# EAGLE design display_board (EAGLE 5.11)
DRAWING_NAME: ARVP Display Board; DRAWING_REV: 1.0; DRAWING_TITLE: Displ
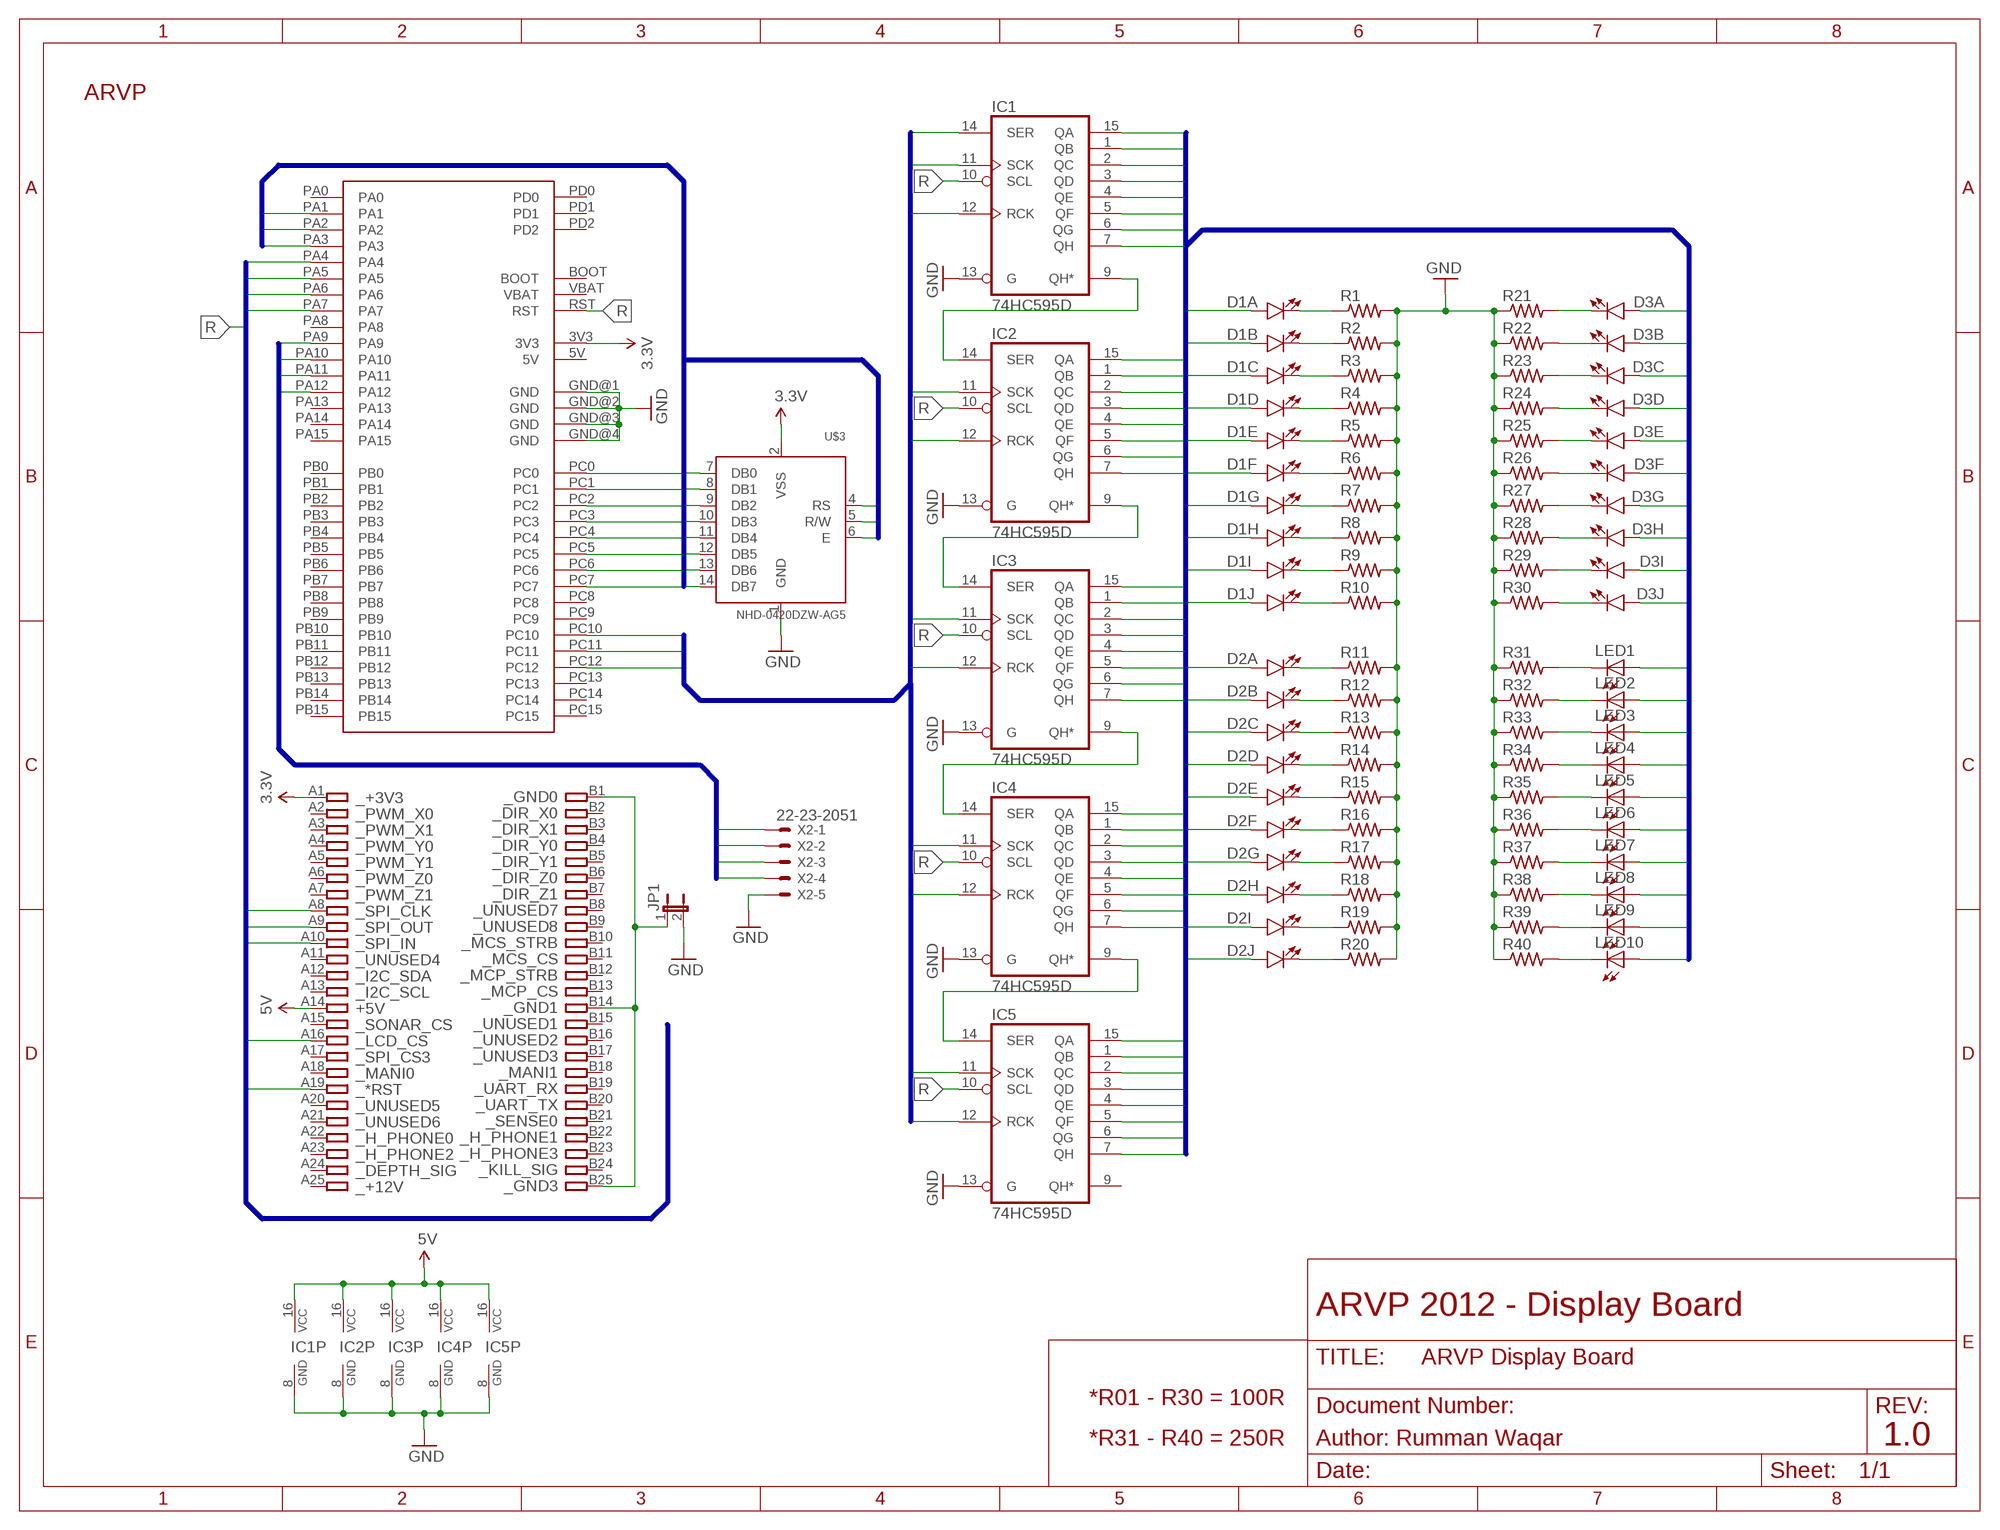
[diagram p0: schematic, sheet 1]

## Parts
D1  LED_BARGRAPH_10  [LED_BARGAPH_10]
D2  LED_BARGRAPH_10  [LED_BARGAPH_10]
D3  LED_BARGRAPH_10  [LED_BARGAPH_10]
IC1  74HC595D  [SO16]
IC2  74HC595D  [SO16]
IC3  74HC595D  [SO16]
IC4  74HC595D  [SO16]
IC5  74HC595D  [SO16]
JP1  JUMPER-2PTH  [1X02]
LED1  LED1206  [LED-1206]
LED2  LED1206  [LED-1206]
LED3  LED1206  [LED-1206]
LED4  LED1206  [LED-1206]
LED5  LED1206  [LED-1206]
LED6  LED1206  [LED-1206]
LED7  LED1206  [LED-1206]
LED8  LED1206  [LED-1206]
LED9  LED1206  [LED-1206]
LED10  LED1206  [LED-1206]
R1  R-US_R0805  [R0805]
R2  R-US_R0805  [R0805]
R3  R-US_R0805  [R0805]
R4  R-US_R0805  [R0805]
R5  R-US_R0805  [R0805]
R6  R-US_R0805  [R0805]
R7  R-US_R0805  [R0805]
R8  R-US_R0805  [R0805]
R9  R-US_R0805  [R0805]
R10  R-US_R0805  [R0805]
R11  R-US_R0805  [R0805]
R12  R-US_R0805  [R0805]
R13  R-US_R0805  [R0805]
R14  R-US_R0805  [R0805]
R15  R-US_R0805  [R0805]
R16  R-US_R0805  [R0805]
R17  R-US_R0805  [R0805]
R18  R-US_R0805  [R0805]
R19  R-US_R0805  [R0805]
R20  R-US_R0805  [R0805]
R21  R-US_R0805  [R0805]
R22  R-US_R0805  [R0805]
R23  R-US_R0805  [R0805]
R24  R-US_R0805  [R0805]
R25  R-US_R0805  [R0805]
R26  R-US_R0805  [R0805]
R27  R-US_R0805  [R0805]
R28  R-US_R0805  [R0805]
R29  R-US_R0805  [R0805]
R30  R-US_R0805  [R0805]
R31  R-US_R0805  [R0805]
R32  R-US_R0805  [R0805]
R33  R-US_R0805  [R0805]
R34  R-US_R0805  [R0805]
R35  R-US_R0805  [R0805]
R36  R-US_R0805  [R0805]
R37  R-US_R0805  [R0805]
R38  R-US_R0805  [R0805]
R39  R-US_R0805  [R0805]
R40  R-US_R0805  [R0805]
U$1  STM32_DISCOVERY  [STM32_DISCOVERY]
U$2  CARD_50PIN  [CARD_50PIN]
U$3  NHD-0420DZW-AG5  [CHARLCD_16PIN]
U$6  ARVP_LOGO  [ARVP]
X2  22-23-2051  [22-23-2051]

## Nets
3.3V: U$1.3V3 U$2.A1 U$3.2(VSS)
5V: IC1.16(VCC) IC2.16(VCC) IC3.16(VCC) IC4.16(VCC) IC5.16(VCC) U$2.A14
_SPI_CLK: U$1.PA5 U$2.A8
_SPI_IN: U$1.PA6 U$2.A10
_SPI_OUT: U$1.PA7 U$2.A9
_SPI_SS: U$1.PA4 U$2.A16
_UART_CTS: U$1.PA11 X2.3
_UART_RTS: U$1.PA12 X2.4
_UART_RX: U$1.PA10 X2.2
_UART_TX: U$1.PA9 X2.1
BAR_A1: D1.1(A:A) IC1.15(QA)
BAR_A2: D1.2(B:A) IC1.1(QB)
BAR_A3: D1.3(C:A) IC1.2(QC)
BAR_A4: D1.4(D:A) IC1.3(QD)
BAR_A5: D1.5(E:A) IC1.4(QE)
BAR_A6: D1.6(F:A) IC1.5(QF)
BAR_A7: D1.7(G:A) IC1.6(QG)
BAR_A8: D1.8(H:A) IC1.7(QH)
BAR_A9: D1.9(I:A) IC2.15(QA)
BAR_A10: D1.10(J:A) IC2.1(QB)
BAR_B1: D2.1(A:A) IC2.2(QC)
BAR_B2: D2.2(B:A) IC2.3(QD)
BAR_B3: D2.3(C:A) IC2.4(QE)
BAR_B4: D2.4(D:A) IC2.5(QF)
BAR_B5: D2.5(E:A) IC2.6(QG)
BAR_B6: D2.6(F:A) IC2.7(QH)
BAR_B7: D2.7(G:A) IC3.15(QA)
BAR_B8: D2.8(H:A) IC3.1(QB)
BAR_B9: D2.9(I:A) IC3.2(QC)
BAR_B10: D2.10(J:A) IC3.3(QD)
BAR_C1: D3.1(A:A) IC3.4(QE)
BAR_C2: D3.2(B:A) IC3.5(QF)
BAR_C3: D3.3(C:A) IC3.6(QG)
BAR_C4: D3.4(D:A) IC3.7(QH)
BAR_C5: D3.5(E:A) IC4.15(QA)
BAR_C6: D3.6(F:A) IC4.1(QB)
BAR_C7: D3.7(G:A) IC4.2(QC)
BAR_C8: D3.8(H:A) IC4.3(QD)
BAR_C9: D3.9(I:A) IC4.4(QE)
BAR_C10: D3.10(J:A) IC4.5(QF)
DB0: U$1.PC0 U$3.7(DB0)
DB1: U$1.PC1 U$3.8(DB1)
DB2: U$1.PC2 U$3.9(DB2)
DB3: U$1.PC3 U$3.10(DB3)
DB4: U$1.PC4 U$3.11(DB4)
DB5: U$1.PC5 U$3.12(DB5)
DB6: U$1.PC6 U$3.13(DB6)
DB7: U$1.PC7 U$3.14(DB7)
DS: IC1.14(SER) U$1.PC12
E: U$1.PA3 U$3.6(E)
GND: IC1.8(GND) IC1.13(G) IC2.8(GND) IC2.13(G) IC3.8(GND) IC3.13(G) IC4.8(GND) IC4.13(G) IC5.8(GND) IC5.13(G) JP1.2 R1.2 R2.2 R3.2 R4.2 R5.2 R6.2 R7.2 R8.2 R9.2 R10.2 R11.2 R12.2 R13.2 R14.2 R15.2 R16.2 R17.2 R18.2 R19.2 R20.2 R21.1 R22.1 R23.1 R24.1 R25.1 R26.1 R27.1 R28.1 R29.1 R30.1 R31.1 R32.1 R33.1 R34.1 R35.1 R36.1 R37.1 R38.1 R39.1 R40.1 U$1.GND@1(GND) U$1.GND@2(GND) U$1.GND@3(GND) U$1.GND@4(GND) U$3.1(GND) X2.5
LED1: IC4.6(QG) LED1.A
LED2: IC4.7(QH) LED2.A
LED3: IC5.15(QA) LED3.A
LED4: IC5.1(QB) LED4.A
LED5: IC5.2(QC) LED5.A
LED6: IC5.3(QD) LED6.A
LED7: IC5.4(QE) LED7.A
LED8: IC5.5(QF) LED8.A
LED9: IC5.6(QG) LED9.A
LED10: IC5.7(QH) LED10.A
N$1: D1.20(A:C) R1.1
N$2: D1.19(B:C) R2.1
N$3: D1.18(C:C) R3.1
N$4: D1.17(D:C) R4.1
N$5: D1.16(E:C) R5.1
N$6: D1.15(F:C) R6.1
N$7: D1.14(G:C) R7.1
N$8: D1.13(H:C) R8.1
N$9: D1.12(I:C) R9.1
N$10: D1.11(J:C) R10.1
N$11: D2.20(A:C) R11.1
N$12: D2.19(B:C) R12.1
N$13: D2.18(C:C) R13.1
N$14: D2.17(D:C) R14.1
N$15: D2.16(E:C) R15.1
N$16: D2.15(F:C) R16.1
N$17: D2.14(G:C) R17.1
N$18: D2.13(H:C) R18.1
N$19: D2.12(I:C) R19.1
N$20: D2.11(J:C) R20.1
N$21: LED10.C R40.2
N$22: LED9.C R39.2
N$23: LED8.C R38.2
N$24: LED7.C R37.2
N$25: LED6.C R36.2
N$26: LED5.C R35.2
N$27: LED4.C R34.2
N$28: LED3.C R33.2
N$29: LED2.C R32.2
N$30: LED1.C R31.2
N$31: D3.11(J:C) R30.2
N$32: D3.12(I:C) R29.2
N$33: D3.13(H:C) R28.2
N$34: D3.14(G:C) R27.2
N$35: D3.15(F:C) R26.2
N$36: D3.16(E:C) R25.2
N$37: D3.17(D:C) R24.2
N$38: D3.18(C:C) R23.2
N$39: D3.19(B:C) R22.2
N$40: D3.20(A:C) R21.2
N$41: IC3.9(QH*) IC4.14(SER)
N$42: IC4.9(QH*) IC5.14(SER)
N$46: JP1.1 U$2.B1 U$2.B14 U$2.B25
N$49: IC1.9(QH*) IC2.14(SER)
N$50: IC2.9(QH*) IC3.14(SER)
R: IC1.10(SCL) IC2.10(SCL) IC3.10(SCL) IC4.10(SCL) IC5.10(SCL) U$1.RST U$2.A19
RS: U$1.PA1 U$3.4(RS)
RW: U$1.PA2 U$3.5(R/W)
SH_CP: IC1.11(SCK) IC2.11(SCK) IC3.11(SCK) IC4.11(SCK) IC5.11(SCK) U$1.PC10
ST_CP: IC1.12(RCK) IC2.12(RCK) IC3.12(RCK) IC4.12(RCK) IC5.12(RCK) U$1.PC11
Unconnected: IC5.9(QH*) U$1.5V U$1.BOOT U$1.NC@1(NC) U$1.NC@2(NC) U$1.PA0 U$1.PA8 U$1.PA13 U$1.PA14 U$1.PA15 U$1.PB0 U$1.PB1 U$1.PB2 U$1.PB3 U$1.PB4 U$1.PB5 U$1.PB6 U$1.PB7 U$1.PB8 U$1.PB9 U$1.PB10 U$1.PB11 U$1.PB12 U$1.PB13 U$1.PB14 U$1.PB15 U$1.PC8 U$1.PC9 U$1.PC13 U$1.PC14 U$1.PC15 U$1.PD0 U$1.PD1 U$1.PD2 U$1.VBAT U$2.A2 U$2.A3 U$2.A4 U$2.A5 U$2.A6 U$2.A7 U$2.A11 U$2.A12 U$2.A13 U$2.A15 U$2.A17 U$2.A18 U$2.A20 U$2.A21 U$2.A22 U$2.A23 U$2.A24 U$2.A25 U$2.B2 U$2.B3 U$2.B4 U$2.B5 U$2.B6 U$2.B7 U$2.B8 U$2.B9 U$2.B10 U$2.B11 U$2.B12 U$2.B13 U$2.B15 U$2.B16 U$2.B17 U$2.B18 U$2.B19 U$2.B20 U$2.B21 U$2.B22 U$2.B23 U$2.B24

## Buses
RS,RW,E,DB[0..7]
BAR_A[1..10],BAR_B[1..10],BAR_C[1..10],LED[1..10]
DS,SH_CP,ST_CP
_SPI_IN,_SPI_OUT,_SPI_CLK,_SPI_SS,R
_UART_RX,_UART_TX,_UART_RTS,_UART_CTS

## Notes on the sheet
- ARVP 2012 - Display Board
- *R01 - R30 = 100R
- *R31 - R40 = 250R | Author: Rumman Waqar | 1.0

## Library data of the parts
D1-D3 = SparkFun:LED_BARGRAPH_10: 10-Segment LED Bar Graph SFE part numbers: COM-09935 (red, Vf = 2.1V, Ifmax = 20mA) COM-09936 (yellow, Vf = 2.1V, Ifmax = 20mA) COM-09937 (blue, Vf = 3.4V, Ifmax = 20mA) COM-09938 (green, Vf = 3.4V, Ifmax = 20mA)
IC1-IC5 = 74xx-eu:74*595: 8-bit SHIFT REGISTER, output latch
JP1 = SparkFun:JUMPER-2: Jumper Basic 0.1" spaced jumper. Use with breakaway headers.
LED1-LED10 = SparkFun:LED: LEDs Standard schematic elements and footprints for 5mm, 3mm, 1206, and 0603 sized LEDs. 5mm - Spark Fun Electronics SKU : COM-00529 (and others)
R1-R40 = rcl:R-US_: RESISTOR, American symbol
U$1 = stm32_discovery:STM32_DISCOVERY: STM32 Value line discovery
U$2 = ARVP:CARD_50PIN
U$3 = Display:NHD-0420DZW-AG5: 20 x 4 Character OLED DIsplay Module
U$6 = ARVP:ARVP_LOGO
X2 = con-molex:22-23-2051: .100" (2.54mm) Center Header - 5 Pin; MF: MOLEX; MPN: 22-23-2051; OC_FARNELL: 1462952; OC_NEWARK: 38C9178

## Board
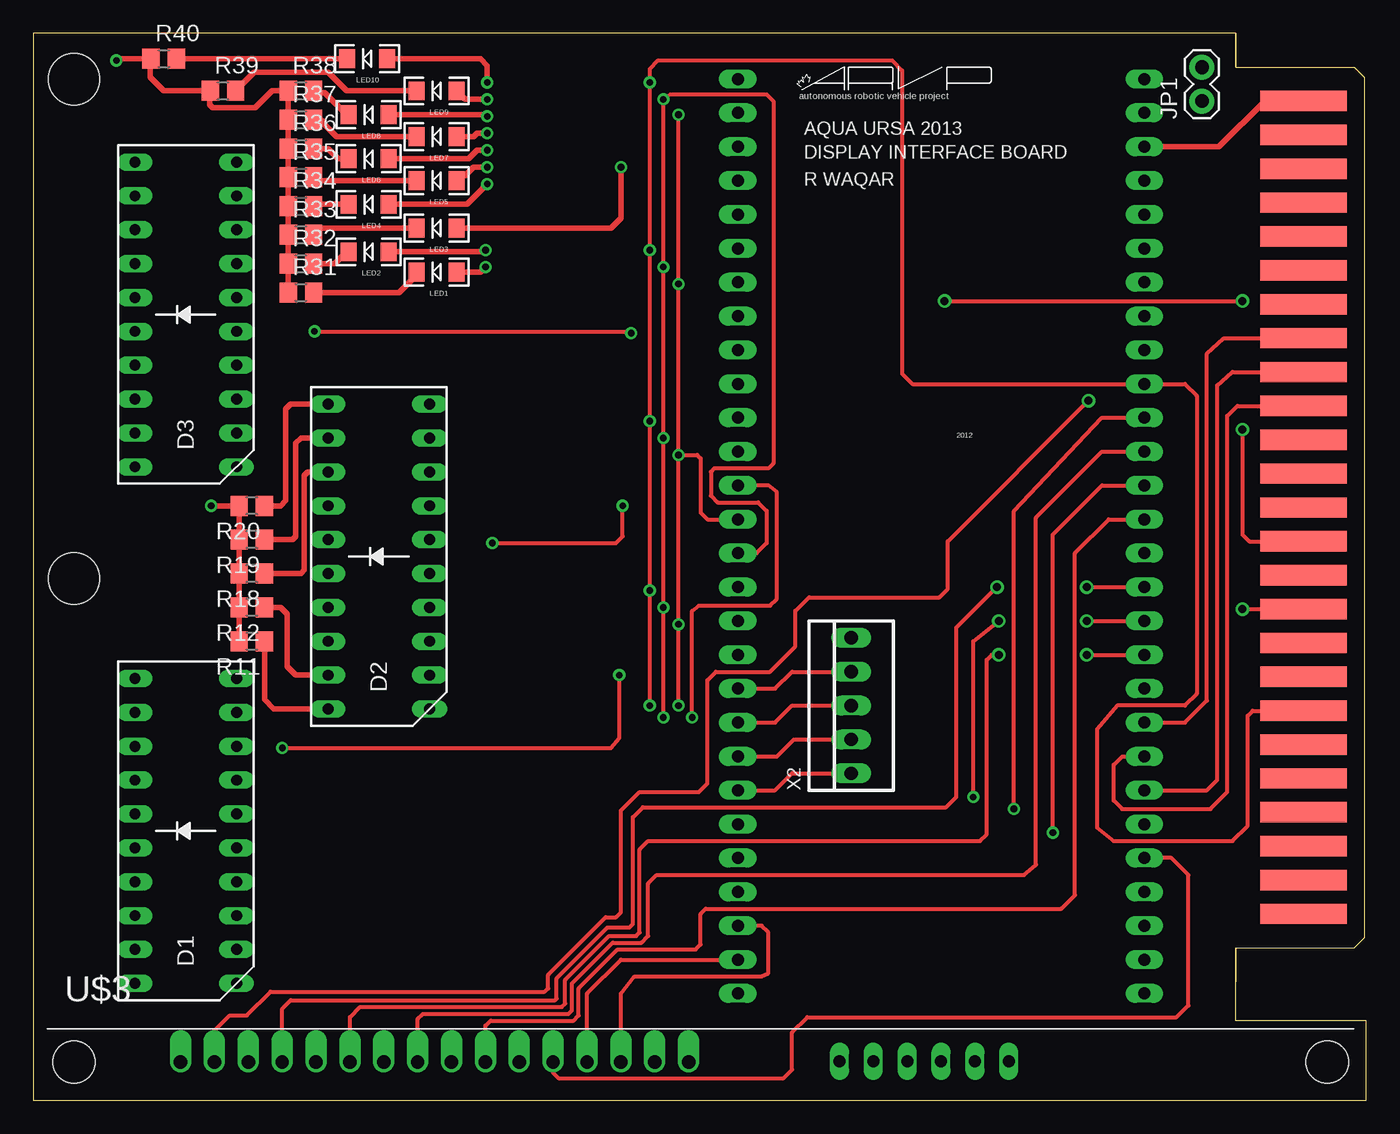
[diagram p1: board, top side]
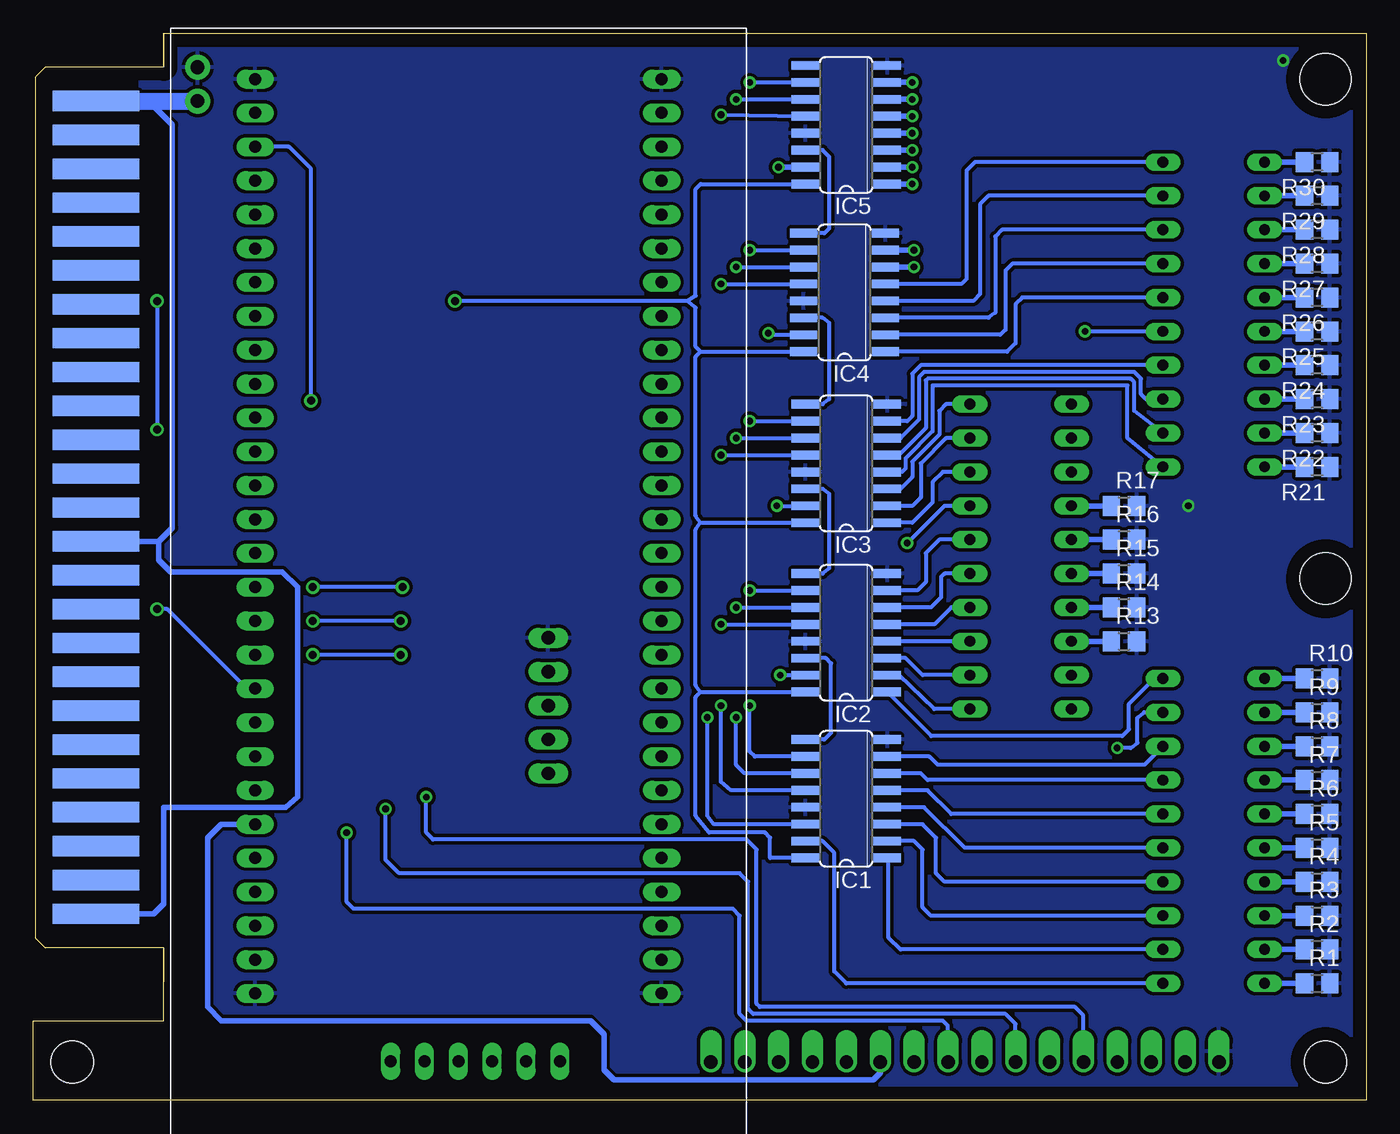
[diagram p2: board, bottom side, seen from below]

Size 99.95 x 80.01 mm. Coordinates in mm from the lower left corner, seen from the top.
Outline: 90.17,11.43 90.17,5.97 99.95,5.97 99.95,0 0,0 0,80 90.17,80.01 90.17,77.46
Copper layers (1*16): Top 0.035mm / dielectric 1.5mm / Bottom 0.035mm
Design rules "default *": minimum track width 10mil, minimum drill 19mil, track to track 7mil, track to pad 7mil, pad to pad 7mil, via to via 7mil, smd to smd 7mil, copper to edge 40mil, drill to drill 8mil, minimum pad ring 10mil, minimum via ring 8mil, stop-mask expansion 4mil, vias tented up to drill 0mil, thermal gap 10mil
Holes 3.86 mm at 3.05,39.12 3.05,76.58

### Footprints (pad centres in the part's own frame; a part is rotated, then mirrored left to right if it is on the bottom)
LED_BARGAPH_10 = drill 0.813 long: 1 -11.43,-3.81; 2 -8.89,-3.81; 3 -6.35,-3.81; 4 -3.81,-3.81; 5 -1.27,-3.81; 6 1.27,-3.81; 7 3.81,-3.81; 8 6.35,-3.81; 9 8.89,-3.81; 10 11.43,-3.81; 11 11.43,3.81; 12 8.89,3.81; 13 6.35,3.81; 14 3.81,3.81; 15 1.27,3.81; 16 -1.27,3.81; 17 -3.81,3.81; 18 -6.35,3.81; 19 -8.89,3.81; 20 -11.43,3.81
SO16 = smd 0.66 x 2.032: 1 -4.445,-3.073; 2 -3.175,-3.073; 3 -1.905,-3.073; 4 -0.635,-3.073; 5 0.635,-3.073; 6 1.905,-3.073; 7 3.175,-3.073; 8 4.445,-3.073; 9 4.445,3.073; 10 3.175,3.073; 11 1.905,3.073; 12 0.635,3.073; 13 -0.635,3.073; 14 -1.905,3.073; 15 -3.175,3.073; 16 -4.445,3.073
1X02 = drill 1.016 pad 1.88 round: 1 0,0; 2 2.54,0
LED-1206 = smd 1.2 x 1.4: A -1.5,0; C 1.5,0
R0805 = smd 1.3 x 1.5: 1 -0.95,0; 2 0.95,0
STM32_DISCOVERY = drill 0.9 long: 3V3 -15.24,29.21; 5V 15.24,29.21; BOOT 15.24,21.59; GND@1 -15.24,34.29; GND@2 15.24,34.29; GND@3 -15.24,-34.29; GND@4 15.24,-34.29; NC@1 -15.24,31.75; NC@2 15.24,31.75; PA0 -15.24,-1.27; PA1 -15.24,-3.81; PA2 -15.24,-6.35; PA3 -15.24,-8.89; PA4 -15.24,-11.43; PA5 -15.24,-13.97; PA6 -15.24,-16.51; PA7 -15.24,-19.05; PA8 15.24,-21.59; PA9 15.24,-19.05; PA10 15.24,-16.51; PA11 15.24,-13.97; PA12 15.24,-11.43; PA13 15.24,-8.89; PA14 15.24,-6.35; PA15 15.24,-3.81; PB0 -15.24,-26.67; PB1 -15.24,-29.21; PB2 -15.24,-31.75; PB3 15.24,8.89; PB4 15.24,11.43; PB5 15.24,13.97; PB6 15.24,16.51; PB7 15.24,19.05; PB8 15.24,24.13; PB9 15.24,26.67; PB10 -5.08,-39.37; PB11 -2.54,-39.37; PB12 0,-39.37; PB13 2.54,-39.37; PB14 5.08,-39.37; PB15 7.62,-39.37; PC0 -15.24,8.89; PC1 -15.24,6.35; PC2 -15.24,3.81; PC3 -15.24,1.27; PC4 -15.24,-21.59; PC5 -15.24,-24.13; PC6 15.24,-31.75; PC7 15.24,-29.21; PC8 15.24,-26.67; PC9 15.24,-24.13; PC10 15.24,-1.27; PC11 15.24,1.27; PC12 15.24,3.81; PC13 -15.24,24.13; PC14 -15.24,21.59; PC15 -15.24,19.05; PD0 -15.24,16.51; PD1 -15.24,13.97; PD2 15.24,6.35; RST -15.24,11.43; VBAT -15.24,26.67
CARD_50PIN = smd 1.524 x 6.477: A1 63.5,3.81; A2 60.96,3.81; A3 58.42,3.81; A4 55.88,3.81; A5 53.34,3.81; A6 50.8,3.81; A7 48.26,3.81; A8 45.72,3.81; A9 43.18,3.81; A10 40.64,3.81; A11 38.1,3.81; A12 35.56,3.81; A13 33.02,3.81; A14 30.48,3.81; A15 27.94,3.81; A16 25.4,3.81; A17 22.86,3.81; A18 20.32,3.81; A19 17.78,3.81; A20 15.24,3.81; A21 12.7,3.81; A22 10.16,3.81; A23 7.62,3.81; A24 5.08,3.81; A25 2.54,3.81 | smd 1.524 x 6.477 bottom: B1 63.5,3.81; B2 60.96,3.81; B3 58.42,3.81; B4 55.88,3.81; B5 53.34,3.81; B6 50.8,3.81; B7 48.26,3.81; B8 45.72,3.81; B9 43.18,3.81; B10 40.64,3.81; B11 38.1,3.81; B12 35.56,3.81; B13 33.02,3.81; B14 30.48,3.81; B15 27.94,3.81; B16 25.4,3.81; B17 22.86,3.81; B18 20.32,3.81; B19 17.78,3.81; B20 15.24,3.81; B21 12.7,3.81; B22 10.16,3.81; B23 7.62,3.81; B24 5.08,3.81; B25 2.54,3.81
CHARLCD_16PIN = drill 1 pad 1.6 offset: 1 -39,27.5; 2 -36.46,27.5; 3 -33.92,27.5; 4 -31.38,27.5; 5 -28.84,27.5; 6 -26.3,27.5; 7 -23.76,27.5; 8 -21.22,27.5; 9 -18.68,27.5; 10 -16.14,27.5; 11 -13.6,27.5; 12 -11.06,27.5; 13 -8.52,27.5; 14 -5.98,27.5; 15 -3.44,27.5; 16 -0.9,27.5 | hole 3.175: -47,27.5; 47,27.5
22-23-2051 = drill 1 long: 1 -5.08,0; 2 -2.54,0; 3 0,0; 4 2.54,0; 5 5.08,0

### Placement (x,y rotation side)
D1  11.43,20.19 90 top
D2  25.91,40.77 90 top
D3  11.43,58.93 90 top
IC1  38.99,22.61 90 bottom
IC2  38.99,35.05 90 bottom
IC3  38.99,47.75 90 bottom
IC4  39.12,60.58 90 bottom
IC5  38.99,73.15 90 bottom
JP1  87.63,74.93 90 top
LED1  30.23,62.1 180 top
LED2  25.15,63.63 180 top
LED3  30.23,65.41 180 top
LED4  25.15,67.18 180 top
LED5  30.23,68.96 180 top
LED6  25.15,70.61 180 top
LED7  30.23,72.26 180 top
LED8  25.15,73.91 180 top
LED9  30.23,75.69 180 top
LED10  25.02,78.11 180 top
R1  3.68,8.76 0 bottom
R2  3.68,11.3 0 bottom
R3  3.68,13.84 0 bottom
R4  3.68,16.38 0 bottom
R5  3.68,18.92 0 bottom
R6  3.68,21.46 0 bottom
R7  3.68,24 0 bottom
R8  3.68,26.54 0 bottom
R9  3.68,29.08 0 bottom
R10  3.68,31.62 0 bottom
R11  16.38,34.42 180 top
R12  16.38,36.96 180 top
R13  18.16,34.42 0 bottom
R14  18.16,36.96 0 bottom
R15  18.16,39.5 0 bottom
R16  18.16,42.04 0 bottom
R17  18.16,44.58 0 bottom
R18  16.38,39.5 180 top
R19  16.38,42.04 180 top
R20  16.38,44.58 180 top
R21  3.68,47.5 180 bottom
R22  3.68,50.04 180 bottom
R23  3.68,52.58 180 bottom
R24  3.68,55.12 180 bottom
R25  3.68,57.66 180 bottom
R26  3.68,60.2 180 bottom
R27  3.68,62.74 180 bottom
R28  3.68,65.28 180 bottom
R29  3.68,67.82 180 bottom
R30  3.68,70.36 180 bottom
R31  20.07,60.58 0 top
R32  20.07,62.74 0 top
R33  20.07,64.9 0 top
R34  20.07,67.06 0 top
R35  20.07,69.22 0 top
R36  20.07,71.37 0 top
R37  20.07,73.53 0 top
R38  20.07,75.69 0 top
R39  14.22,75.69 0 top
R40  9.78,78.11 0 top
U$1  68.07,42.29 0 bottom
U$2  99.06,11.43 90 top
U$3  50.04,-24.64 0 top
U$6  57.4,75.06 0 top
X2  61.34,29.59 90 top

### Tracks (layer width: path | path; a pad name or v marks a point on that pad's centre or on a via)
3.3V  (via drill 0.6)
  Top 0.305: v79.12,52.45 68.58,41.91 68.58,38.35 67.94,37.72 58.17,37.72 57.15,36.7 57.15,34.04 55.24,32.13 51.18,32.13 50.55,31.5 50.55,23.75 49.91,23.11 45.47,23.11 44.07,21.72 44.07,14.1 43.69,13.72 42.93,13.72 38.61,9.4 38.61,8.38 38.35,8.13 17.78,8.13 16,6.35 14.73,6.35 13.58,5.2 U$3.2
  Top 0.406: U$2.A1 92.33,74.93 88.9,71.5 U$1.3V3
  Bottom 0.305: v79.12,52.45 79.12,69.85 80.77,71.5 U$1.3V3
5V  (via drill 0.6)
  Top 0.305: U$2.A14 91.19,41.91 90.68,42.42 v90.68,50.29 | v68.33,59.94 v90.68,59.94
  Bottom 0.305: IC1.16 44.7,18.16 44.7,19.68 45.09,20.07 49.28,20.07 50.29,21.34 50.29,30.23 49.91,30.61 | 49.91,30.61 IC2.16 | 49.91,43.31 IC3.16 | 49.91,43.31 50.29,42.8 50.29,31.11 49.91,30.61 | 49.91,56.13 IC4.16 | 49.91,56.13 50.29,55.75 50.29,43.81 49.91,43.31 | IC5.16 49.91,68.71 50.29,68.33 50.29,60.33 50.93,59.94 | 49.91,56.13 50.29,56.52 50.29,59.44 50.93,59.94 | 50.93,59.94 v68.33,59.94 | v90.68,59.94 v90.68,50.29
_SPI_CLK
  Top 0.305: U$1.PA5 86.36,28.32 88.01,29.97 88.01,56.01 89.28,57.15 U$2.A8
_SPI_IN
  Top 0.305: U$1.PA6 81.66,25.78 81.03,25.15 81.03,22.48 81.66,21.84 88.27,21.84 89.53,23.11 89.53,51.31 90.3,52.07 U$2.A10
_SPI_OUT
  Top 0.305: U$2.A9 89.92,54.61 88.77,53.59 88.77,24 88.01,23.24 U$1.PA7
_SPI_SS  (via drill 0.6)
  Top 0.305: v90.68,36.83 U$2.A16
  Bottom 0.305: U$1.PA4 83.95,30.86 89.92,36.83 v90.68,36.83
_UART_CTS
  Top 0.305: U$1.PA11 55.63,28.32 56.9,29.59 X2.3
_UART_RTS
  Top 0.305: U$1.PA12 55.63,30.86 56.9,32.13 X2.4
_UART_RX
  Top 0.305: X2.2 57.02,27.05 55.75,25.78 U$1.PA10
_UART_TX
  Top 0.305: U$1.PA9 55.63,23.24 56.9,24.51 X2.1
BAR_A1
  Bottom 0.305: D1.1 38.99,8.76 39.88,9.65 39.88,18.54 40.77,19.43 IC1.15
BAR_A2
  Bottom 0.305: D1.2 34.92,11.3 35.81,12.19 35.81,18.06 IC1.1
BAR_A3
  Bottom 0.305: D1.3 32.64,13.84 33.27,14.48 33.27,18.8 33.91,19.43 IC1.2
BAR_A4
  Bottom 0.305: D1.4 31.62,16.38 32.26,17.02 32.26,19.68 33.27,20.7 IC1.3
BAR_A5
  Bottom 0.305: D1.5 30.1,18.92 33.15,21.97 IC1.4
BAR_A6
  Bottom 0.305: D1.6 31.11,21.46 32.89,23.24 IC1.5
BAR_A7
  Bottom 0.305: D1.7 32.89,24 33.4,24.51 IC1.6
BAR_A8
  Bottom 0.305: D1.8 16.64,25.15 32.13,25.15 32.77,25.78 IC1.7
BAR_A9  (via drill 0.5 pad 0.3)
  Top 0.305: v18.67,26.42 43.31,26.42 43.94,27.18 v43.94,31.88
  Bottom 0.305: D1.9 16.64,29.08 17.14,28.7 17.14,26.8 17.65,26.42 v18.67,26.42 | v43.94,31.88 IC2.15
BAR_A10
  Bottom 0.305: D1.10 15.88,31.62 17.78,29.72 17.78,27.81 18.29,27.3 32.61,27.3 IC2.1
BAR_B1
  Bottom 0.305: D2.1 32.38,29.34 35.05,31.88 IC2.2
BAR_B2
  Bottom 0.305: D2.2 33.27,31.88 34.54,33.15 IC2.3
BAR_B3
  Bottom 0.305: D2.3 IC2.4
BAR_B4
  Bottom 0.305: D2.4 31.11,36.96 32.38,35.69 IC2.5
BAR_B5
  Bottom 0.305: D2.5 31.62,39.5 31.88,39.24 31.88,37.72 32.64,36.96 IC2.6
BAR_B6
  Bottom 0.305: IC2.7 33.66,38.23 33.02,38.86 33.02,41.02 32,42.04 D2.6
BAR_B7  (via drill 0.5 pad 0.3)
  Top 0.305: v34.42,41.78 43.69,41.78 44.2,42.29 v44.2,44.58
  Bottom 0.305: v44.2,44.58 IC3.15 | D2.7 31.62,44.58 v34.42,41.78
BAR_B8
  Bottom 0.305: IC3.1 34.04,43.31 32.51,44.83 32.51,46.35 31.75,47.12 D2.8
BAR_B9
  Bottom 0.305: IC3.2 34.04,44.58 33.4,45.21 33.4,47.75 31.5,49.66 D2.9
BAR_B10
  Bottom 0.305: IC3.3 34.92,45.85 34.04,46.74 34.04,47.88 32,49.91 32,51.69 31.5,52.2 D2.10
BAR_C1
  Bottom 0.305: D3.1 17.91,49.66 17.91,53.59 32.51,53.59 32.51,50.16 34.54,48.13 34.54,47.37 34.8,47.12 IC3.4
BAR_C2
  Bottom 0.305: IC3.5 35.05,48.39 33.02,50.42 33.02,53.98 32.89,54.1 17.65,54.1 17.4,53.85 17.4,51.69 D3.2
BAR_C3
  Bottom 0.305: IC3.6 34.92,49.66 33.53,51.05 33.53,54.23 33.15,54.61 17.4,54.61 16.89,54.1 16.89,52.96 16.51,52.58 D3.3
BAR_C4
  Bottom 0.305: D3.4 33.4,55.12 34.04,54.48 34.04,51.31 34.42,50.93 IC3.7
BAR_C5  (via drill 0.5 pad 0.3)
  Top 0.305: v21.08,57.66 44.7,57.66 v44.83,57.53
  Bottom 0.305: D3.5 v21.08,57.66 | IC4.15 44.7,57.4 v44.83,57.53
BAR_C6
  Bottom 0.305: D3.6 25.78,60.2 26.29,59.69 26.29,56.77 26.92,56.13 IC4.1
BAR_C7
  Bottom 0.305: D3.7 26.54,62.74 27.05,62.23 27.05,57.78 27.43,57.4 IC4.2
BAR_C8
  Bottom 0.305: IC4.3 28.32,58.67 27.81,59.05 27.81,64.77 27.3,65.28 D3.8
BAR_C9
  Bottom 0.305: D3.9 28.32,67.82 28.96,67.18 28.96,60.45 29.46,59.94 IC4.4
BAR_C10
  Bottom 0.305: IC4.5 30.35,61.21 29.97,61.59 29.97,69.72 29.34,70.36 D3.10
DB0  (via drill 0.5 pad 0.3)
  Top 0.305: U$1.PC0 80.14,51.18 73.53,44.2 v73.53,21.84 | U$3.7 26.29,2.87
  Bottom 0.305: v73.53,21.84 73.53,18.03 72.52,17.02 46.99,17.02 46.35,16.38 46.35,6.86 45.97,6.48 27.05,6.48 26.29,5.71 26.29,2.87 U$3.7
DB1
  Top 0.305: U$1.PC1 80.14,48.64 75.18,43.69 75.18,17.65 74.3,16.89 46.74,16.89 46.1,16.26 46.1,12.32 45.59,11.81 43.43,11.81 40.39,8.76 40.39,6.73 40.13,6.48 29.21,6.48 28.83,6.1 28.83,5.33 28.82,5.32 U$3.8
DB2  (via drill 0.5 pad 0.3)
  Top 0.305: U$1.PC2 80.14,46.1 76.45,42.42 v76.45,20.07
  Bottom 0.305: v76.45,20.07 76.45,14.86 75.95,14.35 47.5,14.35 46.99,13.84 46.99,6.48 46.48,5.97 31.75,5.97 31.37,5.59 31.37,2.87 U$3.9
DB3
  Top 0.305: U$1.PC3 80.64,43.56 78.11,41.02 78.11,15.37 77.09,14.35 50.42,14.35 50.04,13.97 50.04,11.68 49.66,11.3 43.81,11.3 40.89,8.38 40.89,6.35 40.51,5.97 34.29,5.97 33.91,5.59 33.91,2.87 U$3.10
DB4
  Bottom 0.406: U$3.11 36.44,2.04 36.96,1.52 56.39,1.52 57.15,2.29 57.15,4.95 58.17,5.97 85.85,5.97 86.87,6.99 86.87,19.68 85.85,20.7 U$1.PC4
DB5
  Top 0.305: U$3.12 38.98,2.04 39.37,1.65 56.26,1.65 56.9,2.29 56.9,5.08 58.04,6.22 85.72,6.22 86.61,7.11 86.61,16.89 85.34,18.16 U$1.PC5
DB6
  Top 0.305: U$1.PC6 44.07,10.54 41.53,8 41.53,2.87 U$3.13
DB7
  Top 0.305: U$3.14 44.06,7.99 45.09,9.27 54.61,9.27 55.12,9.53 55.12,12.57 54.61,13.08 U$1.PC7
DS  (via drill 0.5 pad 0.3)
  Top 0.305: v49.4,28.7 49.4,36.7 49.91,37.08 55.24,37.08 55.75,37.59 55.75,45.59 55.12,46.1 U$1.PC12
  Bottom 0.305: IC1.14 48.9,20.7 49.4,21.34 v49.4,28.7
E  (via drill 0.6)
  Top 0.305: v78.99,33.4 U$1.PA3 | v72.39,33.4 71.88,33.4 71.5,33.02 71.5,19.94 70.99,19.43 46.1,19.43 45.47,18.8 45.47,12.57 45.21,12.32 43.18,12.32 39.88,9.02 39.88,7.24 39.62,6.99 24.51,6.99 23.75,6.22 23.75,2.87 U$3.6
  Bottom 0.305: v72.39,33.4 v78.99,33.4
GND  (via drill 0.5 pad 0.3)
  Top 0.406: R31.1 R32.1 R33.1 R34.1 R35.1 | R35.1 19.18,69.22 | R35.1 R36.1 R37.1 R38.1 17.91,75.69 16.64,74.42 13.46,74.42 13.21,74.68 13.21,75.63 R39.1 9.78,75.69 8.76,76.71 8.76,78.04 R40.1 6.35,78.11 v6.22,77.98 | R11.2 R12.2 R18.2 R19.2 R20.2 v13.34,44.58
  pour Bottom (isolate 0.254): 0,80.01 91.95,80.01 91.82,0.13 0,0
LED1  (via drill 0.5 pad 0.3)
  Top 0.406: LED1.A 33.53,62.1 v33.91,62.48
  Bottom 0.406: v33.91,62.48 IC4.6
LED2  (via drill 0.5 pad 0.3)
  Top 0.406: LED2.A 33.78,63.63 v33.91,63.75
  Bottom 0.406: v33.91,63.75 IC4.7
LED3  (via drill 0.5 pad 0.3)
  Top 0.406: LED3.A 43.31,65.41 44.07,66.17 v44.07,69.98
  Bottom 0.406: v44.07,69.98 IC5.15
LED4  (via drill 0.5 pad 0.3)
  Top 0.406: LED4.A 32.51,67.18 v34.04,68.71
  Bottom 0.406: v34.04,68.71 IC5.1
LED5  (via drill 0.5 pad 0.3)
  Top 0.406: v34.04,69.98 33.02,69.98 32.38,69.34 32.11,69.34 LED5.A
  Bottom 0.406: v34.04,69.98 IC5.2
LED6  (via drill 0.5 pad 0.3)
  Top 0.406: LED6.A 32.64,70.61 33.27,71.25 v34.04,71.25
  Bottom 0.406: v34.04,71.25 IC5.3
LED7  (via drill 0.5 pad 0.3)
  Top 0.406: LED7.A 33.02,72.26 33.27,72.52 v34.04,72.52
  Bottom 0.406: v34.04,72.52 IC5.4
LED8  (via drill 0.5 pad 0.3)
  Top 0.406: LED8.A 33.91,73.91 v34.04,73.79
  Bottom 0.406: v34.04,73.79 IC5.5
LED9  (via drill 0.5 pad 0.3)
  Top 0.406: v34.04,75.06 32.36,75.06 LED9.A
  Bottom 0.406: v34.04,75.06 IC5.6
LED10  (via drill 0.5 pad 0.3)
  Top 0.406: LED10.A 33.53,78.11 34.04,77.6 v34.04,76.33
  Bottom 0.406: v34.04,76.33 IC5.7
N$1
  Bottom 0.406: R1.1 D1.20
N$2
  Bottom 0.406: R2.1 D1.19
N$3
  Bottom 0.406: R3.1 D1.18
N$4
  Bottom 0.406: R4.1 D1.17
N$5
  Bottom 0.406: R5.1 D1.16
N$6
  Bottom 0.406: R6.1 D1.15
N$7
  Bottom 0.406: R7.1 D1.14
N$8
  Bottom 0.406: R8.1 D1.13
N$9
  Bottom 0.406: R9.1 D1.12
N$10
  Bottom 0.406: R10.1 D1.11
N$11
  Top 0.406: R11.1 17.33,30.04 18.03,29.34 D2.20
N$12
  Top 0.406: D2.19 19.68,31.88 19.05,32.51 19.05,36.45 18.54,36.96 R12.1
N$13
  Bottom 0.406: R13.1 D2.18
N$14
  Bottom 0.406: R14.1 D2.17
N$15
  Bottom 0.406: R15.1 D2.16
N$16
  Bottom 0.406: R16.1 D2.15
N$17
  Bottom 0.406: R17.1 D2.14
N$18
  Top 0.406: R18.1 20.07,39.5 20.32,39.75 20.32,46.86 20.57,47.12 D2.13
N$19
  Top 0.406: R19.1 19.43,42.04 19.68,42.29 19.68,49.28 20.07,49.66 D2.12
N$20
  Top 0.406: D2.11 19.3,52.2 18.92,51.82 18.92,44.96 18.54,44.58 R20.1
N$21
  Top 0.406: R40.2 LED10.C
N$22
  Top 0.406: LED9.C 23.5,75.69 22.1,77.09 16.57,77.09 R39.2
N$23
  Top 0.406: LED8.C 23.5,73.91 21.84,75.56 21.14,75.56 R38.2
N$24
  Top 0.406: LED7.C 22.73,72.26 21.72,73.28 21.72,73.41 21.59,73.53 R37.2
N$25
  Top 0.406: LED6.C 22.86,70.61 22.1,71.37 R36.2
N$26
  Top 0.406: LED5.C 21.27,68.96 R35.2
N$27
  Top 0.406: LED4.C 21.14,67.18 R34.2
N$28
  Top 0.406: LED3.C 21.52,65.41 R33.2
N$29
  Top 0.406: LED2.C 23.5,63.63 22.61,62.74 R32.2
N$30
  Top 0.406: LED1.C 28.73,61.87 27.43,60.58 R31.2
N$31
  Bottom 0.406: R30.2 D3.11
N$32
  Bottom 0.406: R29.2 D3.12
N$33
  Bottom 0.406: R28.2 D3.13
N$34
  Bottom 0.406: R27.2 D3.14
N$35
  Bottom 0.406: R26.2 D3.15
N$36
  Bottom 0.406: R25.2 D3.16
N$37
  Bottom 0.406: R24.2 D3.17
N$38
  Bottom 0.406: R23.2 D3.18
N$39
  Bottom 0.406: R22.2 D3.19
N$40
  Bottom 0.406: R21.2 D3.20
N$41
  Bottom 0.305: IC3.9 40.77,52.2 40.26,52.58 40.26,58.29 40.77,58.67 IC4.14
N$42
  Bottom 0.305: IC4.9 40.64,65.02 40.26,65.41 40.26,70.74 40.77,71.25 IC5.14
N$46
  Bottom 0.406: U$2.B1 91.31,74.93 89.53,73.15 89.53,42.93 90.55,41.91 | 90.55,41.91 U$2.B14 | U$2.B25 90.93,13.97 90.17,14.73 90.17,21.97 81.03,21.97 80.14,22.73 80.14,38.48 81.28,39.62 89.66,39.62 90.55,40.51 90.55,41.91
  Bottom 1.27: U$2.B1 JP1.1
N$49
  Bottom 0.305: IC1.9 40.64,27.05 40.13,27.56 40.13,32.77 40.51,33.15 IC2.14
N$50
  Bottom 0.305: IC2.9 40.77,39.5 40.26,39.88 40.26,45.47 40.77,45.85 IC3.14
R  (via drill 0.5 pad 0.3)
  Top 0.305: U$2.A19 91.44,29.21 91.06,28.83 91.06,20.57 89.92,19.43 81.03,19.43 79.76,20.45 79.76,27.81 81.28,29.59 86.36,29.59 87.25,30.48 87.25,52.83 86.36,53.72 U$1.RST 65.91,53.72 65.15,54.48 65.15,77.22 64.39,77.98 46.86,77.98 46.23,77.34 v46.23,76.33 v46.23,63.75 v46.23,50.93 v46.23,38.23 v46.23,29.59
  Bottom 0.305: IC1.10 45.85,25.78 46.23,26.16 v46.23,29.59 | v46.23,38.23 IC2.10 | v46.23,50.93 IC3.10 | v46.23,63.75 IC4.10 | v46.23,76.33 IC5.10
RS  (via drill 0.6)
  Top 0.305: v78.99,38.48 U$1.PA1 | v72.26,38.48 69.22,35.43 69.22,22.73 68.45,21.97 45.72,21.97 44.96,21.21 44.96,13.21 44.7,12.95 43.05,12.95 39.24,9.14 39.24,7.62 39.12,7.49 19.3,7.49 18.67,6.86 18.67,4.95 18.67,2.87 U$3.4
  Bottom 0.305: v72.26,38.48 v78.99,38.48
RW  (via drill 0.5 pad 0.3, 0.6)
  Top 0.305: v78.99,35.94 U$1.PA2 | U$3.5 21.2,5.07 | v70.48,22.73 70.48,34.42 v72.39,35.94
  Bottom 0.305: v72.39,35.94 v78.99,35.94 | v70.48,22.73 70.48,20.07 69.98,19.56 46.48,19.56 45.72,18.8 45.72,7.24 45.47,6.99 21.84,6.99 21.21,6.35 21.21,2.87 U$3.5
SH_CP  (via drill 0.5 pad 0.3)
  Top 0.305: v47.24,28.7 v47.24,36.96 v47.24,49.66 v47.24,62.48 v47.24,75.06 47.75,75.44 54.99,75.44 55.5,74.93 55.5,47.75 55.12,47.37 51.05,47.37 50.8,47.12 50.8,45.34 51.31,44.83 54.36,44.83 54.99,44.2 54.99,41.78 54.23,41.02 U$1.PC10
  Bottom 0.305: IC1.11 46.61,24.51 47.24,25.15 v47.24,28.7 | v47.24,36.96 IC2.11 | v47.24,49.66 IC3.11 | v47.24,62.48 IC4.11 | v47.24,75.06 IC5.11
ST_CP  (via drill 0.5 pad 0.3)
  Top 0.305: v48.39,29.59 v48.39,35.69 v48.39,48.39 | v48.39,48.39 v48.39,61.21 v48.39,73.91 | v48.39,48.39 49.78,48.39 50.04,48.13 50.04,44.07 50.55,43.56 U$1.PC11
  Bottom 0.305: IC1.12 47.62,23.24 48.39,23.88 v48.39,29.59 | v48.39,35.69 IC2.12 | v48.39,48.39 IC3.12 | v48.39,61.21 IC4.12 | v48.39,73.91 IC5.12

### Text on the board
tPlace: AQUA URSA 2013 | DISPLAY INTERFACE BOARD | R WAQAR | 2012